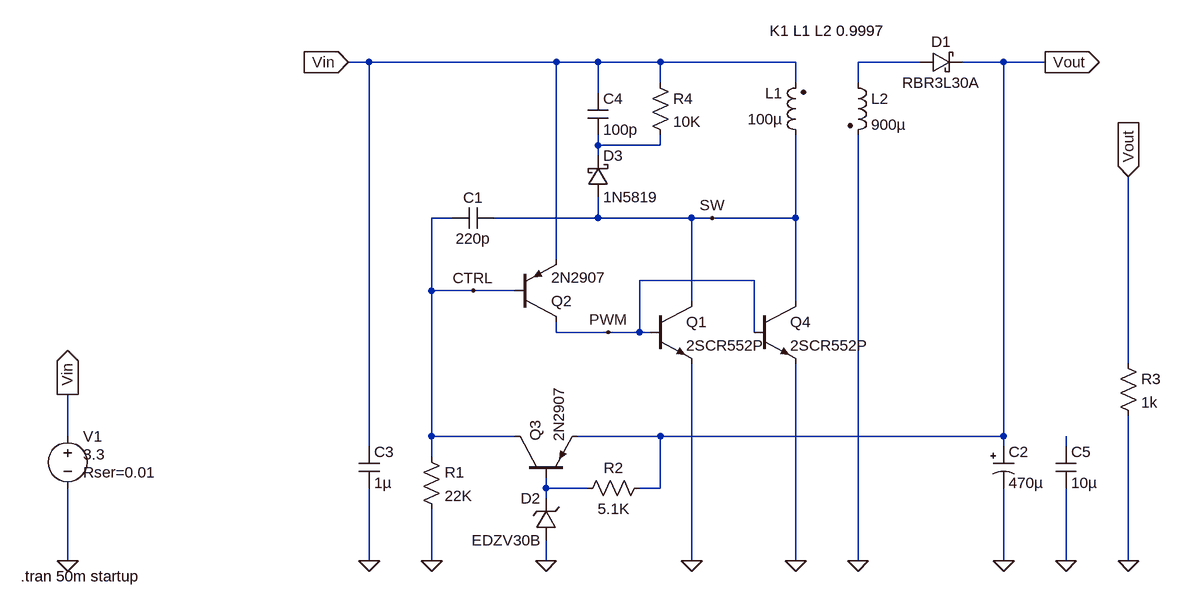
[diagram p0: schematic Flyback_SMPL.asc]
Flyback_SMPL.asc, the LTspice schematic file:
Version 4
SHEET 1 1032 760
WIRE -208 -48 -240 -48
WIRE 80 -48 -208 -48
WIRE 144 -48 80 -48
WIRE 240 -48 144 -48
WIRE 448 -48 240 -48
WIRE 640 -48 544 -48
WIRE 768 -48 704 -48
WIRE 832 -48 768 -48
WIRE 240 -16 240 -48
WIRE 448 -16 448 -48
WIRE 544 -16 544 -48
WIRE 144 0 144 -48
WIRE 144 80 144 64
WIRE 240 80 240 64
WIRE 240 80 144 80
WIRE 144 96 144 80
WIRE -80 192 -112 192
WIRE 144 192 144 160
WIRE 144 192 -16 192
WIRE 288 192 144 192
WIRE 320 192 288 192
WIRE 448 192 448 64
WIRE 448 192 320 192
WIRE 80 256 80 -48
WIRE 384 288 208 288
WIRE -112 304 -112 192
WIRE -48 304 -112 304
WIRE 16 304 -48 304
WIRE 288 320 288 192
WIRE 448 320 448 192
WIRE 80 368 80 352
WIRE 160 368 80 368
WIRE 208 368 208 288
WIRE 208 368 160 368
WIRE 224 368 208 368
WIRE 384 368 384 288
WIRE 960 416 960 128
WIRE -672 528 -672 464
WIRE -112 528 -112 304
WIRE 16 528 -112 528
WIRE 240 528 112 528
WIRE 768 528 768 -48
WIRE 768 528 240 528
WIRE -208 544 -208 -48
WIRE 768 544 768 528
WIRE 864 544 864 528
WIRE -112 560 -112 528
WIRE 64 608 64 592
WIRE 128 608 64 608
WIRE 240 608 240 528
WIRE 240 608 208 608
WIRE 64 624 64 608
WIRE -672 720 -672 608
WIRE -208 720 -208 608
WIRE -112 720 -112 640
WIRE 64 720 64 688
WIRE 288 720 288 416
WIRE 448 720 448 416
WIRE 544 720 544 64
WIRE 768 720 768 608
WIRE 864 720 864 608
WIRE 960 720 960 496
FLAG 288 720 0
FLAG 768 720 0
FLAG 64 720 0
FLAG -112 720 0
FLAG -208 720 0
FLAG -240 -48 Vin
IOPIN -240 -48 In
FLAG 832 -48 Vout
IOPIN 832 -48 Out
FLAG -672 720 0
FLAG -672 464 Vin
IOPIN -672 464 Out
FLAG 320 192 SW
FLAG 160 368 PWM
FLAG -48 304 CTRL
FLAG 960 720 0
FLAG 960 128 Vout
IOPIN 960 128 In
FLAG 448 720 0
FLAG 544 720 0
FLAG 864 720 0
SYMBOL ind2 464 80 R180
WINDOW 0 36 80 Left 2
WINDOW 3 36 40 Left 2
SYMATTR InstName L1
SYMATTR Value 100µ
SYMATTR SpiceLine Ipk=3 Rser=0.152 Rpar=9420 Cpar=0
SYMATTR Type ind
SYMBOL npn2 224 320 R0
SYMATTR InstName Q1
SYMATTR Value 2SCR552P
SYMBOL schottky 640 -32 R270
WINDOW 0 32 32 VTop 2
WINDOW 3 0 32 VBottom 2
SYMATTR InstName D1
SYMATTR Value RBR3L30A
SYMATTR Description Diode
SYMATTR Type diode
SYMBOL pnp 16 352 M180
SYMATTR InstName Q2
SYMATTR Value 2N2907
SYMBOL cap -16 176 R90
WINDOW 0 0 32 VBottom 2
WINDOW 3 32 32 VTop 2
SYMATTR InstName C1
SYMATTR Value 220p
SYMATTR SpiceLine V=25 Irms=22.8m Rser=13.9748 Lser=0 mfg="KEMET" pn="C0402C221K3RAC" type="X7R"
SYMBOL res -128 544 R0
SYMATTR InstName R1
SYMATTR Value 22K
SYMATTR SpiceLine tol=1 pwr=0.1
SYMBOL pnp 16 592 R270
SYMATTR InstName Q3
SYMATTR Value 2N2907
SYMBOL zener 80 688 R180
WINDOW 0 24 64 Left 2
WINDOW 3 24 0 Left 2
SYMATTR InstName D2
SYMATTR Value EDZV30B
SYMATTR Description Diode
SYMATTR Type diode
SYMBOL res 112 624 R270
WINDOW 0 32 56 VTop 2
WINDOW 3 0 56 VBottom 2
SYMATTR InstName R2
SYMATTR Value 5.1K
SYMATTR SpiceLine tol=1 pwr=0.1
SYMBOL polcap 752 544 R0
WINDOW 3 24 56 Left 2
SYMATTR Value 470µ
SYMATTR InstName C2
SYMATTR Description Capacitor
SYMATTR Type cap
SYMATTR SpiceLine V=35 Irms=580m Rser=0.12 Lser=0 mfg="Nichicon" pn="UPR1V471MPH" type="Al electrolytic"
SYMBOL cap -224 544 R0
SYMATTR InstName C3
SYMATTR Value 1µ
SYMATTR SpiceLine V=16 Irms=2.59 Rser=0.0171188 Lser=0 mfg="KEMET" pn="C0603C105K4RAC" type="X7R"
SYMBOL voltage -672 512 R0
WINDOW 3 24 44 Left 2
WINDOW 123 0 0 Left 0
WINDOW 39 24 72 Left 2
SYMATTR Value 3.3
SYMATTR SpiceLine Rser=0.01
SYMATTR InstName V1
SYMBOL res 944 400 R0
SYMATTR InstName R3
SYMATTR Value 1k
SYMATTR SpiceLine tol=1 pwr=10
SYMBOL npn2 384 320 R0
SYMATTR InstName Q4
SYMATTR Value 2SCR552P
SYMBOL ind2 528 -32 R0
SYMATTR InstName L2
SYMATTR Value 900µ
SYMATTR SpiceLine Ipk=1 Rser=0.152 Rpar=9420 Cpar=0
SYMATTR Type ind
SYMBOL schottky 128 160 M180
WINDOW 0 24 64 Left 2
WINDOW 3 24 0 Left 2
SYMATTR InstName D3
SYMATTR Value 1N5819
SYMATTR Description Diode
SYMATTR Type diode
SYMBOL cap 128 0 R0
SYMATTR InstName C4
SYMATTR Value 100p
SYMATTR SpiceLine V=50 Irms=20.8m Rser=5.448 Lser=0 mfg="KEMET" pn="C0603C101K5RAC" type="X7R"
SYMBOL res 224 -32 R0
SYMATTR InstName R4
SYMATTR Value 10K
SYMATTR SpiceLine tol=1 pwr=0.1
SYMBOL cap 848 544 R0
SYMATTR InstName C5
SYMATTR Value 10µ
SYMATTR SpiceLine V=35 Irms=8.06 Rser=0.00577565 Lser=0 mfg="KEMET" pn="C1210C106K6PAC" type="X5R"
TEXT -744 744 Left 2 !.tran 50m startup
TEXT 408 -96 Left 2 !K1 L1 L2 0.9997

The netlist it stands for:
* Flyback_SMPL.asc
L1 SW Vin 100µ Ipk=3 Rser=0.152 Rpar=9420 Cpar=0
Q1 SW PWM 0 0 2SCR552P
D1 N001 Vout RBR3L30A
Q2 PWM CTRL Vin 0 2N2907
C1 SW CTRL 220p V=25 Irms=22.8m Rser=13.9748 Lser=0 mfg="KEMET" pn="C0402C221K3RAC" type="X7R"
R1 CTRL 0 22K tol=1 pwr=0.1
Q3 CTRL N004 Vout 0 2N2907
D2 0 N004 EDZV30B
R2 N004 Vout 5.1K tol=1 pwr=0.1
C2 Vout 0 470µ V=35 Irms=580m Rser=0.12 Lser=0 mfg="Nichicon" pn="UPR1V471MPH" type="Al electrolytic"
C3 Vin 0 1µ V=16 Irms=2.59 Rser=0.0171188 Lser=0 mfg="KEMET" pn="C0603C105K4RAC" type="X7R"
V1 Vin 0 3.3 Rser=0.01
R3 Vout 0 1k tol=1 pwr=10
Q4 SW PWM 0 0 2SCR552P
L2 N001 0 900µ Ipk=1 Rser=0.152 Rpar=9420 Cpar=0
D3 SW N002 1N5819
C4 Vin N002 100p V=50 Irms=20.8m Rser=5.448 Lser=0 mfg="KEMET" pn="C0603C101K5RAC" type="X7R"
R4 Vin N002 10K tol=1 pwr=0.1
C5 N003 0 10µ V=35 Irms=8.06 Rser=0.00577565 Lser=0 mfg="KEMET" pn="C1210C106K6PAC" type="X5R"
.model D D
.lib standard.dio
.model NPN NPN
.model PNP PNP
.lib standard.bjt
.tran 50m startup
K1 L1 L2 0.9997
.backanno
.end